# EAGLE schematic FrontPanel (EAGLE 9.2.2)
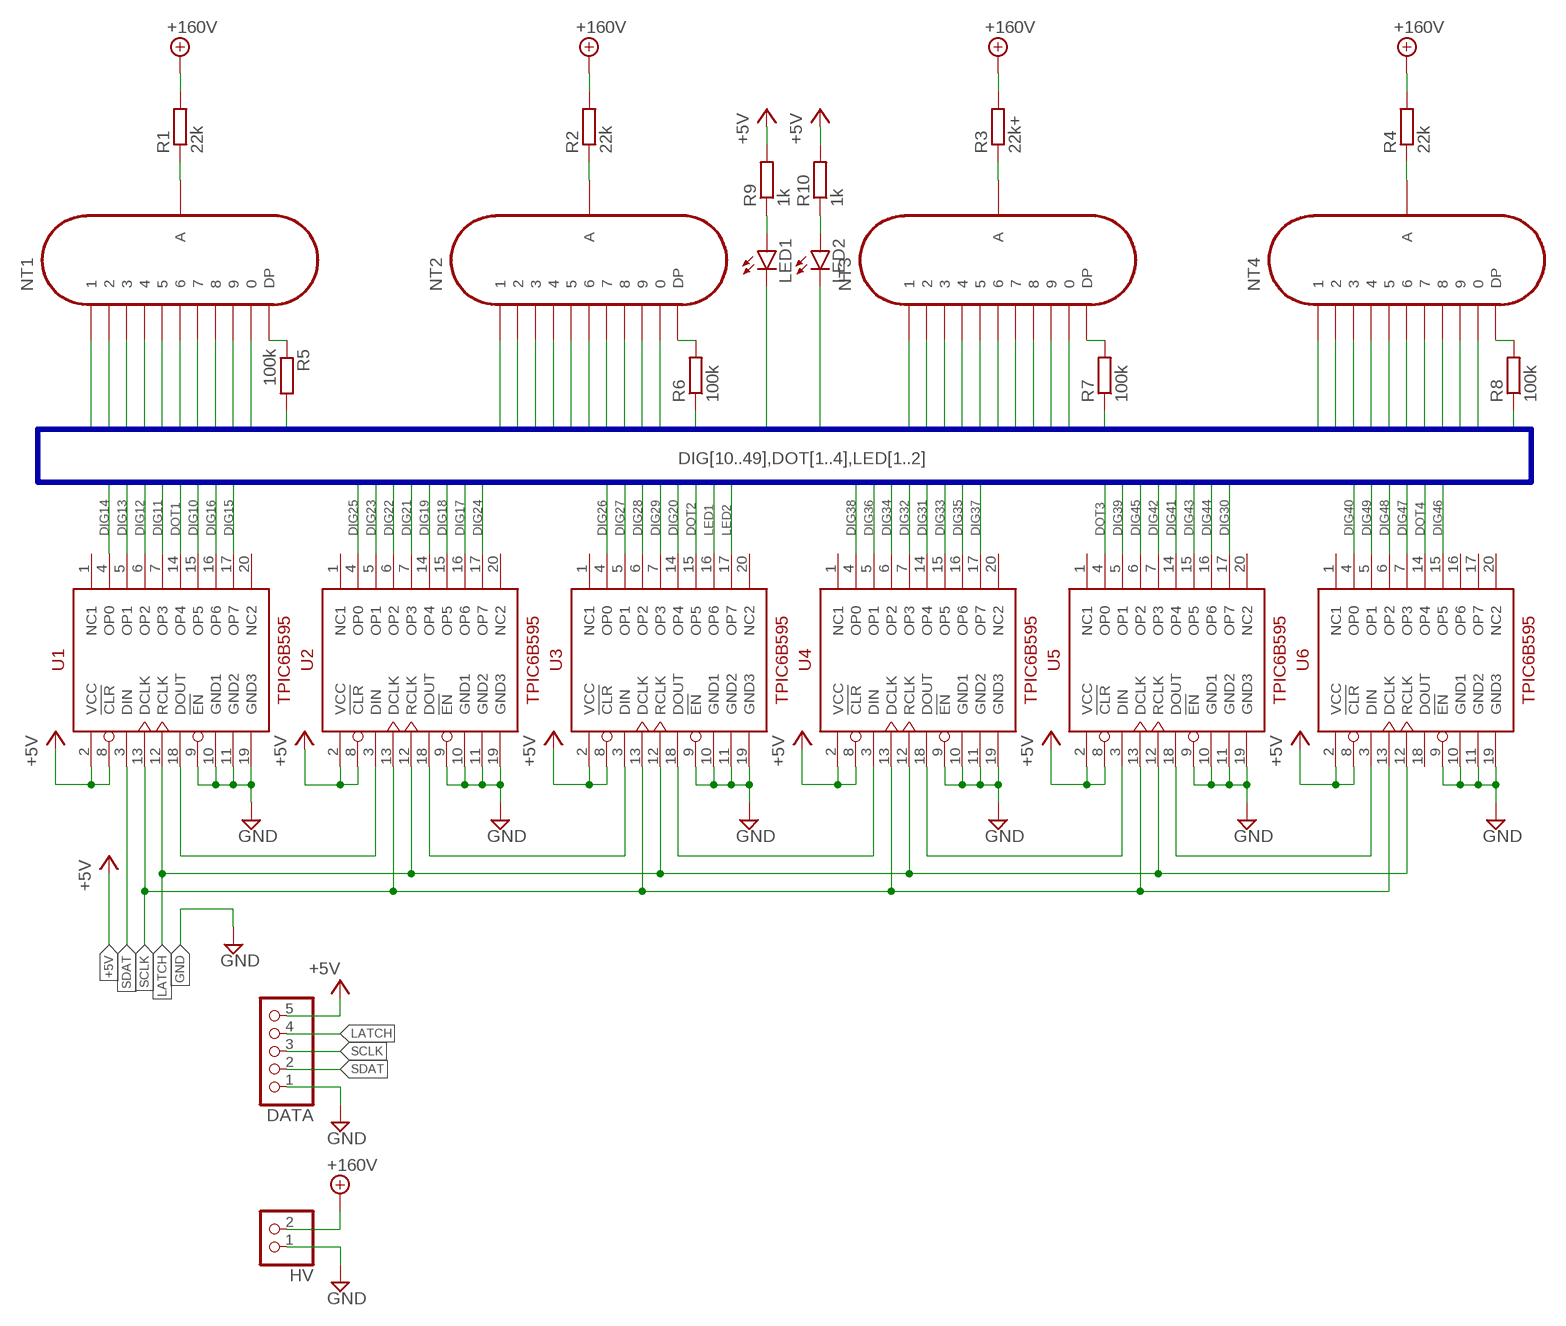
[diagram p0: schematic, sheet 1]

## Parts
DATA  PINHD-1X5  [1X05]
HV  PINHD-1X2  [1X02]
LED1  LED5MM  [LED5MM]
LED2  LED5MM  [LED5MM]
NT1  IN-12B  [IN-12]
NT2  IN-12B  [IN-12]
NT3  IN-12B  [IN-12]
NT4  IN-12B  [IN-12]
R1  22k  R-EU_0207/10  [0207/10]
R2  22k  R-EU_0207/10  [0207/10]
R3  22k+  R-EU_0207/10  [0207/10]
R4  22k  R-EU_0207/10  [0207/10]
R5  100k  R-EU_0207/10  [0207/10]
R6  100k  R-EU_0207/10  [0207/10]
R7  100k  R-EU_0207/10  [0207/10]
R8  100k  R-EU_0207/10  [0207/10]
R9  1k  R-EU_0207/10  [0207/10]
R10  1k  R-EU_0207/10  [0207/10]
U1  TPIC6B595N  [PDIP-20]
U2  TPIC6B595N  [PDIP-20]
U3  TPIC6B595N  [PDIP-20]
U4  TPIC6B595N  [PDIP-20]
U5  TPIC6B595N  [PDIP-20]
U6  TPIC6B595N  [PDIP-20]

## Nets
+5V: DATA.5 R9.2 R10.2 U1.2(VCC) U1.8(!CLR) U2.2(VCC) U2.8(!CLR) U3.2(VCC) U3.8(!CLR) U4.2(VCC) U4.8(!CLR) U5.2(VCC) U5.8(!CLR) U6.2(VCC) U6.8(!CLR)
+160V: HV.2 R1.2 R2.2 R3.2 R4.2
DIG10: NT1.0 U1.15(OP5)
DIG11: NT1.1 U1.7(OP3)
DIG12: NT1.2 U1.6(OP2)
DIG13: NT1.3 U1.5(OP1)
DIG14: NT1.4 U1.4(OP0)
DIG15: NT1.5 U1.17(OP7)
DIG16: NT1.6 U1.16(OP6)
DIG17: NT1.7 U2.16(OP6)
DIG18: NT1.8 U2.15(OP5)
DIG19: NT1.9 U2.14(OP4)
DIG20: NT2.0 U3.14(OP4)
DIG21: NT2.1 U2.7(OP3)
DIG22: NT2.2 U2.6(OP2)
DIG23: NT2.3 U2.5(OP1)
DIG24: NT2.4 U2.17(OP7)
DIG25: NT2.5 U2.4(OP0)
DIG26: NT2.6 U3.4(OP0)
DIG27: NT2.7 U3.5(OP1)
DIG28: NT2.8 U3.6(OP2)
DIG29: NT2.9 U3.7(OP3)
DIG30: NT3.0 U5.17(OP7)
DIG31: NT3.1 U4.14(OP4)
DIG32: NT3.2 U4.7(OP3)
DIG33: NT3.3 U4.15(OP5)
DIG34: NT3.4 U4.6(OP2)
DIG35: NT3.5 U4.16(OP6)
DIG36: NT3.6 U4.5(OP1)
DIG37: NT3.7 U4.17(OP7)
DIG38: NT3.8 U4.4(OP0)
DIG39: NT3.9 U5.5(OP1)
DIG40: NT4.0 U6.4(OP0)
DIG41: NT4.1 U5.14(OP4)
DIG42: NT4.2 U5.7(OP3)
DIG43: NT4.3 U5.15(OP5)
DIG44: NT4.4 U5.16(OP6)
DIG45: NT4.5 U5.6(OP2)
DIG46: NT4.6 U6.15(OP5)
DIG47: NT4.7 U6.7(OP3)
DIG48: NT4.8 U6.6(OP2)
DIG49: NT4.9 U6.5(OP1)
DOT1: R5.2 U1.14(OP4)
DOT2: R6.1 U3.15(OP5)
DOT3: R7.1 U5.4(OP0)
DOT4: R8.1 U6.14(OP4)
GND: DATA.1 HV.1 U1.9(!EN) U1.10(GND1) U1.11(GND2) U1.19(GND3) U2.9(!EN) U2.10(GND1) U2.11(GND2) U2.19(GND3) U3.9(!EN) U3.10(GND1) U3.11(GND2) U3.19(GND3) U4.9(!EN) U4.10(GND1) U4.11(GND2) U4.19(GND3) U5.9(!EN) U5.10(GND1) U5.11(GND2) U5.19(GND3) U6.9(!EN) U6.10(GND1) U6.11(GND2) U6.19(GND3)
LATCH: DATA.4 U1.12(RCLK) U2.12(RCLK) U3.12(RCLK) U4.12(RCLK) U5.12(RCLK) U6.12(RCLK)
LED1: LED1.K(C) U3.16(OP6)
LED2: LED2.K(C) U3.17(OP7)
N$45: NT1.LHDP(DP) R5.1
N$46: NT2.LHDP(DP) R6.2
N$47: NT3.LHDP(DP) R7.2
N$48: NT4.LHDP(DP) R8.2
N$49: NT1.A R1.1
N$50: NT2.A R2.1
N$51: NT3.A R3.1
N$52: NT4.A R4.1
N$55: U1.18(DOUT) U2.3(DIN)
N$56: U2.18(DOUT) U3.3(DIN)
N$57: U3.18(DOUT) U4.3(DIN)
N$58: U4.18(DOUT) U5.3(DIN)
N$59: U5.18(DOUT) U6.3(DIN)
N$66: LED1.A R9.1
N$67: LED2.A R10.1
SCLK: DATA.3 U1.13(DCLK) U2.13(DCLK) U3.13(DCLK) U4.13(DCLK) U5.13(DCLK) U6.13(DCLK)
SDAT: DATA.2 U1.3(DIN)
Unconnected: U1.1(NC1) U1.20(NC2) U2.1(NC1) U2.20(NC2) U3.1(NC1) U3.20(NC2) U4.1(NC1) U4.20(NC2) U5.1(NC1) U5.20(NC2) U6.1(NC1) U6.16(OP6) U6.17(OP7) U6.18(DOUT) U6.20(NC2)

## Buses
DIG[10..49],DOT[1..4],LED[1..2]

## Library data of the parts
DATA = pinhead:PINHD-1X5: PIN HEADER
HV = pinhead:PINHD-1X2: PIN HEADER
LED1 LED2 = led:LED: LED OSRAM: - CHIPLED LG R971, LG N971, LY N971, LG Q971, LY Q971, LO R971, LY R971 LH N974, LH R974 LS Q976, LO Q976, LY Q976 LO Q996 - Hyper CHIPLED LW Q18S LB Q993, LB Q99A, LB R99A - SideLED LS A670, LO A670, LY A670, LG A670, LP A670 LB A673, LV A673, LT A673, LW A673 LH A674 LY A675 LS A676, LA A676, LO A676, LY A676, LW A676 LS A679, LY A679, LG A679 - Hyper Micro SIDELED® LS Y876, LA Y876, LO Y876, LY Y876 LT Y87S - SmartLED LW L88C, LW L88S LB L89C, LB L89S, LG L890 LS L89K, LO L89K, LY L89K LS L896, LA L896, LO L896, LY L896 - TOPLED LS T670, LO T670, LY T670, LG T670, LP T670 LSG T670, LSP T670, LSY T670, LOP T670, LYG T670 LG T671, LOG T671, LSG T671 LB T673, LV T673, LT T673, LW T673 LH T674 LS T676, LA T676, LO T676, LY T676, LB T676, LH T676, LSB T676, LW T676 LB T67C, LV T67C, LT T67C, LS T67K, LO T67K, LY T67K, LW E67C LS E67B, LA E67B, LO E67B, LY E67B, LB E67C, LV E67C, LT E67C LW T67C LS T679, LY T679, LG T679 LS T770, LO T770, LY T770, LG T770, LP T770 LB T773, LV T773, LT T773, LW T773 LH T774 LS E675, LA E675, LY E675, LS T675 LS T776, LA T776, LO T776, LY T776, LB T776 LHGB T686 LT T68C, LB T68C - Hyper Mini TOPLED® LB M676 - Mini TOPLED Santana® LG M470 LS M47K, LO M47K, LY M47K Source: http://www.osram.convergy.de LUXEON: - LUMILED® LXK2-PW12-R00, LXK2-PW12-S00, LXK2-PW14-U00, LXK2-PW14-V00 LXK2-PM12-R00, LXK2-PM12-S00, LXK2-PM14-U00 LXK2-PE12-Q00, LXK2-PE12-R00, LXK2-PE12-S00, LXK2-PE14-T00, LXK2-PE14-U00 LXK2-PB12-K00, LXK2-PB12-L00, LXK2-PB12-M00, LXK2-PB14-N00, LXK2-PB14-P00, LXK2-PB14-Q00 LXK2-PR12-L00, LXK2-PR12-M00, LXK2-PR14-Q00, LXK2-PR14-R00 LXK2-PD12-Q00, LXK2-PD12-R00, LXK2-PD12-S00 LXK2-PH12-R00, LXK2-PH12-S00 LXK2-PL12-P00, LXK2-PL12-Q00, LXK2-PL12-R00 Source: www.luxeon.com KINGBRIGHT: KA-3528ASYC Source: www.kingbright.com
NT1-NT4 = NixieClock:IN-12B
R1-R10 = rcl:R-EU_: RESISTOR, European symbol; SPICEPREFIX: R
U1-U6 = NixieClock:TPIC6B595